# Altium schematic sheet power.SchDoc
size A4; SheetNumber: 7; SheetTotal: 9
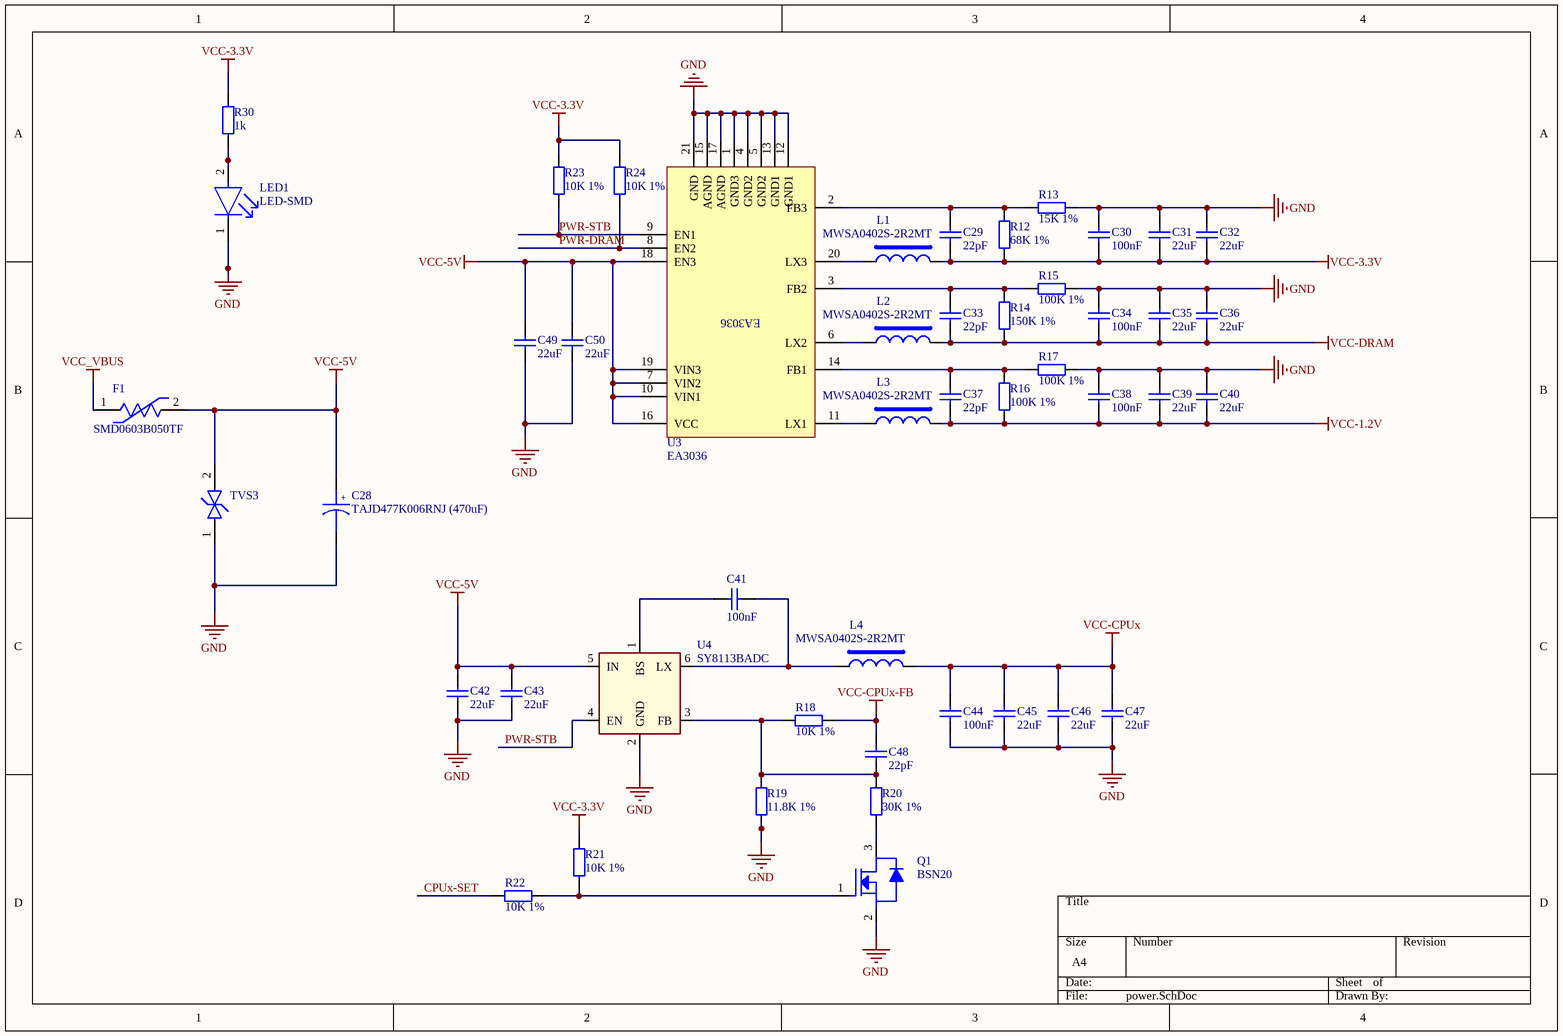
[diagram p0: power.SchDoc]

## Parts
C28  TAJD477K006RNJ (470uF)  [7343_C_POL]
C29  22pF  [0402_C]
C30  100nF  [0402_C]
C31  22uF  [0603_C]
C32  22uF  [0603_C]
C33  22pF  [0402_C]
C34  100nF  [0402_C]
C35  22uF  [0603_C]
C36  22uF  [0603_C]
C37  22pF  [0402_C]
C38  100nF  [0402_C]
C39  22uF  [0603_C]
C40  22uF  [0603_C]
C41  100nF  [0402_C]
C42  22uF  [0603_C]
C43  22uF  [0603_C]
C44  100nF  [0402_C]
C45  22uF  [0603_C]
C46  22uF  [0603_C]
C47  22uF  [0603_C]
C48  22pF  [0402_C]
C49  22uF  [0603_C]
C50  22uF  [0603_C]
F1  SMD0603B050TF  [0603_FUSE]
L1  MWSA0402S-2R2MT  [0402S_L]
L2  MWSA0402S-2R2MT  [0402S_L]
L3  MWSA0402S-2R2MT  [0402S_L]
L4  MWSA0402S-2R2MT  [0402S_L]
LED1  LED-SMD  [0603_LED_BLUE]
Q1  BSN20  [SOT-23]
R12  68K 1%  [0402_R]
R13  15K 1%  [0402_R]
R14  150K 1%  [0402_R]
R15  100K 1%  [0402_R]
R16  100K 1%  [0402_R]
R17  100K 1%  [0402_R]
R18  10K 1%  [0402_R]
R19  11.8K 1%  [0402_R]
R20  30K 1%  [0402_R]
R21  10K 1%  [0402_R]
R22  10K 1%  [0402_R]
R23  10K 1%  [0402_R]
R24  10K 1%  [0402_R]
R30  1k  [0402_R]
TVS3  BSD5C051L  [SOD-523_TVS]  (value not drawn)
U3  EA3036  [QFN3x3-20]
U4  SY8113BADC  [SOT23-6]

## Nets
GND: C28.2 C30.1 C31.1 C32.1 C34.1 C35.1 C36.1 C38.1 C39.1 C40.1 C42.2 C43.2 C44.2 C45.2 C46.2 C47.2 C49.2 C50.2 LED1.1(-) Q1.2(SOURCE) R13.1 R15.1 R17.1 R19.1 TVS3.1 U3.1(GND3) U3.4(GND2) U3.5(GND2) U3.12(GND1) U3.13(GND1) U3.15(AGND) U3.17(AGND) U3.21(GND) U4.2(GND)
VCC-1.2V: C37.2 C38.2 C39.2 C40.2 L3.2 R16.1
VCC-3.3V: C29.2 C30.2 C31.2 C32.2 L1.2 R12.1 R21.2 R23.2 R24.2 R30.2
VCC-5V: C28.1 C42.1 C43.1 C49.1 C50.1 F1.2 TVS3.2 U3.7(VIN2) U3.10(VIN1) U3.16(VCC) U3.18(EN3) U3.19(VIN3) U4.5(IN)
VCC-CPUx: C44.1 C45.1 C46.1 C47.1 L4.2
VCC-CPUx-FB: C48.1 R18.2
VCC-DRAM: C33.2 C34.2 C35.2 C36.2 L2.2 R14.1
VCC_VBUS: F1.1
CPUx-SET: R22.2
PWR-DRAM: R24.1 U3.8(EN2)
PWR-STB: R23.1 U3.9(EN1) U4.4(EN)
NetC29_1: C29.1 R12.2 R13.2 U3.2(FB3)
NetC33_1: C33.1 R14.2 R15.2 U3.3(FB2)
NetC37_1: C37.1 R16.2 R17.2 U3.14(FB1)
NetC41_1: C41.1 U4.1(BS)
NetC41_2: C41.2 L4.1 U4.6(LX)
NetC48_2: C48.2 R18.1 R19.2 R20.2 U4.3(FB)
NetL1_1: L1.1 U3.20(LX3)
NetL2_1: L2.1 U3.6(LX2)
NetL3_1: L3.1 U3.11(LX1)
NetLED1_2: LED1.2(+) R30.1
NetQ1_1: Q1.1(GATE) R21.1 R22.1
NetQ1_3: Q1.3(DRAIN) R20.1

## Notes on the sheet
- (in symbol CAP-POL-SMD) +

## Library data of the parts
C28 = CAP-POL-SMD: smd pol capacitor
C29-C50 = CAP-SMD: smd capacitor
F1 = FUSE-SMD: RESET FUSE
L1-L4 = IND-SMD: inductor
LED1 = LED-SMD: 0603 LED SMD
Q1 = NMOS
R12-R24 R30 = RES-SMD: smd resistor
TVS3 = TVS-DIODE-SMD: Transient Voltage Suppressor
U3 = EA3036: DC-DC
U4 = SY8113BADC: DC-DC